# EAGLE design mostek-h (EAGLE 8.6.3)
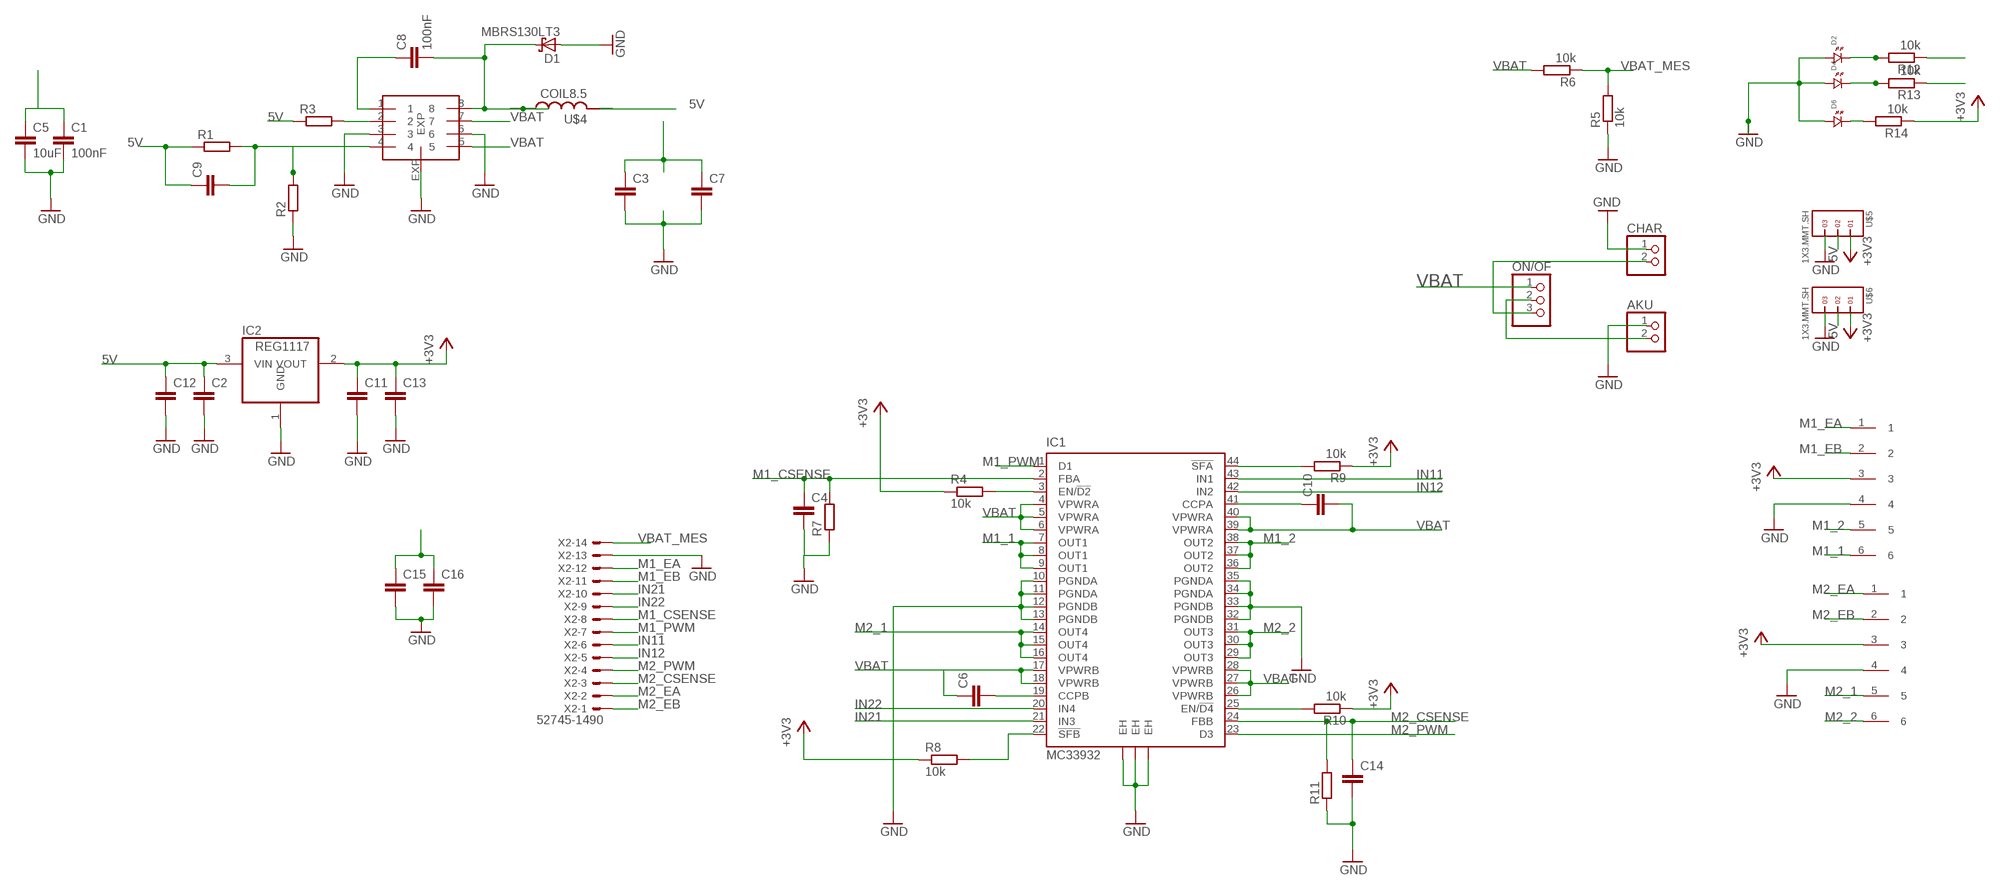
[diagram p0: schematic, sheet 1]

## Parts
AKU  PINHD-1X2/90  [1X02/90]
C1  100nF  C-EUC1210K  [C1210K]
C2  C-EUC0805  [C0805]
C3  C-EUC1210K  [C1210K]
C4  C-EUC0603  [C0603]
C5  10uF  C-EUC0603  [C0603]
C6  C-EUC0805  [C0805]
C7  C-EUC0603  [C0603]
C8  100nF  C-EUC0603  [C0603]
C9  C-EUC0603  [C0603]
C10  C-EUC0805  [C0805]
C11  C-EUC0805  [C0805]
C12  C-EUC1210  [C1210]
C13  C-EUC1210  [C1210]
C14  C-EUC0603  [C0603]
C15  C-EUC1210K  [C1210K]
C16  C-EUC0603  [C0603]
CHAR  PINHD-1X2/90  [1X02/90]
D1  MBRS130LT3  [SMB]
D2  LED.0805  [0805.LED]
D4  LED.0805  [0805.LED]
D6  LED.0805  [0805.LED]
IC1  MC33932  [HSOP44]
IC2  REG1117  [SOT223]
ON/OF  PINHD-1X3/90  [1X03/90]
R1  R-EU_R0603  [R0603]
R2  R-EU_R0603  [R0603]
R3  R-EU_R0603  [R0603]
R4  10k  R-EU_R0603  [R0603]
R5  10k  R-EU_R0603  [R0603]
R6  10k  R-EU_R0603  [R0603]
R7  R-EU_R0603  [R0603]
R8  10k  R-EU_R0603  [R0603]
R9  10k  R-EU_R0603  [R0603]
R10  10k  R-EU_R0603  [R0603]
R11  R-EU_R0603  [R0603]
R12  10k  R-EU_R0603  [R0603]
R13  10k  R-EU_R0603  [R0603]
R14  10k  R-EU_R0603  [R0603]
U$1  PAD_SMD_6X1  [SMD_6X1]
U$2  PAD_SMD_6X1  [SMD_6X1]
U$3  ST1S14  [HSOP8]
U$4  COIL8.5  [COIL1]
U$5  1X3.MMT.SH  [1X3_MMT.103.01.X.SH]
U$6  1X3.MMT.SH  [1X3_MMT.103.01.X.SH]
X2  52745-1490  [52745-1490]

## Nets
5V: C2.1 C3.1 C7.1 C9.1 C12.1 IC2.3(VIN) R1.1 R3.1 R13.1 U$4.2 U$5.2 U$6.2
+3V3: C11.1 C13.1 IC2.2(VOUT) R4.1 R8.1 R9.1 R10.1 R14.1 U$1.3 U$2.3 U$5.1 U$6.1
GND: AKU.1 C1.2 C2.2 C3.2 C4.2 C5.2 C7.2 C11.2 C12.2 C13.2 C14.2 C15.2 C16.2 CHAR.1 D1.A D2.P$1 D4.P$1 D6.P$1 IC1.10(PGNDA) IC1.11(PGNDA) IC1.12(PGNDB) IC1.13(PGNDB) IC1.32(PGNDB) IC1.33(PGNDB) IC1.34(PGNDA) IC1.35(PGNDA) IC1.EH@1(EH) IC1.EH@2(EH) IC1.EH@3(EH) IC2.1(GND) R2.1 R5.1 R7.1 R11.1 U$1.4 U$2.4 U$3.3 U$3.6 U$3.EXP U$5.3 U$6.3 X2.13
IN11: IC1.43(IN1) X2.6
IN12: IC1.42(IN2) X2.5
IN21: IC1.21(IN3) X2.10
IN22: IC1.20(IN4) X2.9
M1_1: IC1.7(OUT1) IC1.8(OUT1) IC1.9(OUT1) U$1.6
M1_2: IC1.36(OUT2) IC1.37(OUT2) IC1.38(OUT2) U$1.5
M1_CSENSE: C4.1 IC1.2(FBA) R7.2 X2.8
M1_EA: U$1.1 X2.12
M1_EB: U$1.2 X2.11
M1_PWM: IC1.1(D1) X2.7
M2_1: IC1.14(OUT4) IC1.15(OUT4) IC1.16(OUT4) U$2.5
M2_2: IC1.29(OUT3) IC1.30(OUT3) IC1.31(OUT3) U$2.6
M2_CSENSE: C14.1 IC1.24(FBB) R11.2 X2.3
M2_EA: U$2.1 X2.2
M2_EB: U$2.2 X2.1
M2_PWM: IC1.23(D3) X2.4
N$1: AKU.2 ON/OF.2
N$2: CHAR.2 ON/OF.3
N$3: C10.1 IC1.41(CCPA)
N$4: C8.1 U$3.1
N$5: C8.2 D1.C U$3.8 U$4.1
N$6: R3.2 U$3.2
N$7: C9.2 R1.2 R2.2 U$3.4
N$8: IC1.3(EN/!D2) R4.2
N$9: C6.2 IC1.19(CCPB)
N$11: IC1.22(!SFB) R8.2
N$12: IC1.25(EN/!D4) R10.2
N$13: IC1.44(!SFA) R9.2
N$17: D2.P$2 R12.2
N$19: D4.P$2 R13.2
N$20: D6.P$2 R14.2
VBAT: C1.1 C5.1 C6.1 C10.2 C15.1 C16.1 IC1.4(VPWRA) IC1.5(VPWRA) IC1.6(VPWRA) IC1.17(VPWRB) IC1.18(VPWRB) IC1.26(VPWRB) IC1.27(VPWRB) IC1.28(VPWRB) IC1.39(VPWRA) IC1.40(VPWRA) ON/OF.1 R6.2 R12.1 U$3.5 U$3.7
VBAT_MES: R5.2 R6.1 X2.14

## Library data of the parts
AKU CHAR = pinhead:PINHD-1X2: PIN HEADER
C1-C16 = rcl:C-EU: CAPACITOR, European symbol; SPICEPREFIX: C
D1 = diode:MBRS130LT3: Schottky Power Rectifier Source: http://www.onsemi.com/pub/Collateral/MBRS130LT3-D.PDF
D2 D4 D6 = standardparts:LED
IC1 = freescale:MC33932: 5.0 A Throttle Control H-Bridge Auto generated by make-symbol-device-package-bsdl.ulp Rev. 33 Source: http://www.freescale.com/files/analog/doc/data_sheet/MC33932.pdf?fpsp=1; MPN: MC33932VW; OC_FARNELL: 1701639; OC_NEWARK: 67P3304
IC2 = burr-brown:REG1117: 800mA and 1A Low Dropout (LDO) Positive Regulator 1.8V, 2.5V, 2.85V, 3.3V, 5V, and Adj; MPN: REG1117; OC_FARNELL: 1097566; OC_NEWARK: 14P6981
ON/OF = pinhead:PINHD-1X3: PIN HEADER
R1-R14 = rcl:R-EU_: RESISTOR, European symbol; SPICEPREFIX: R
U$1 U$2 = _zlacza:PAD_SMD_6X1
U$3 = _układy:ST1S14
U$4 = _elementy:COIL8.5
U$5 U$6 = headers(2mm)(samtec):1X3
X2 = con-molex:52745-1490: FFC/FPC-to-Board 0.50mm (.020") SMT Top Contact Right Angle, ZIF, Style Receptacle 52745 / 52435 Source: http://www.molex.com/product/ffc/52745.html; MF: WALDOM/MOLEX; MPN: 52745-1490; OC_FARNELL: unknown; OC_NEWARK: 38C9888

## Board
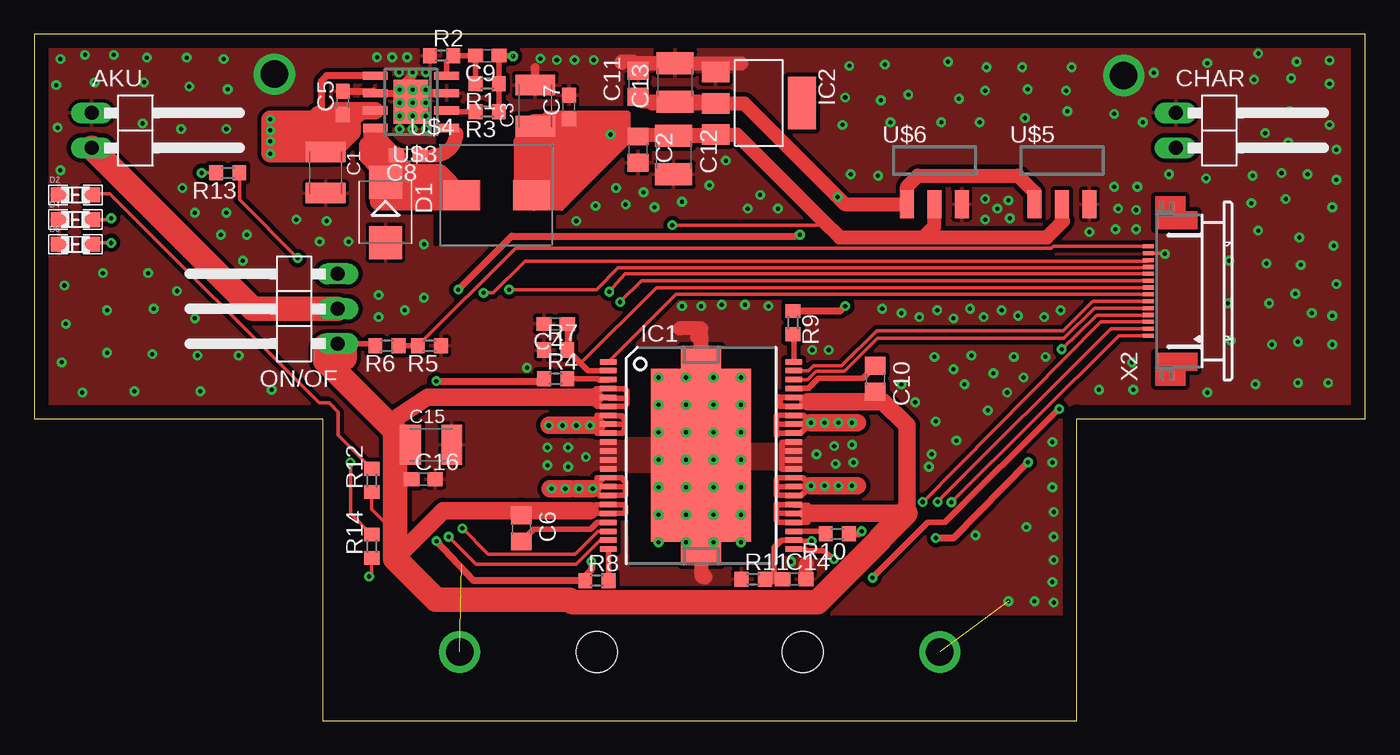
[diagram p1: board, top side]
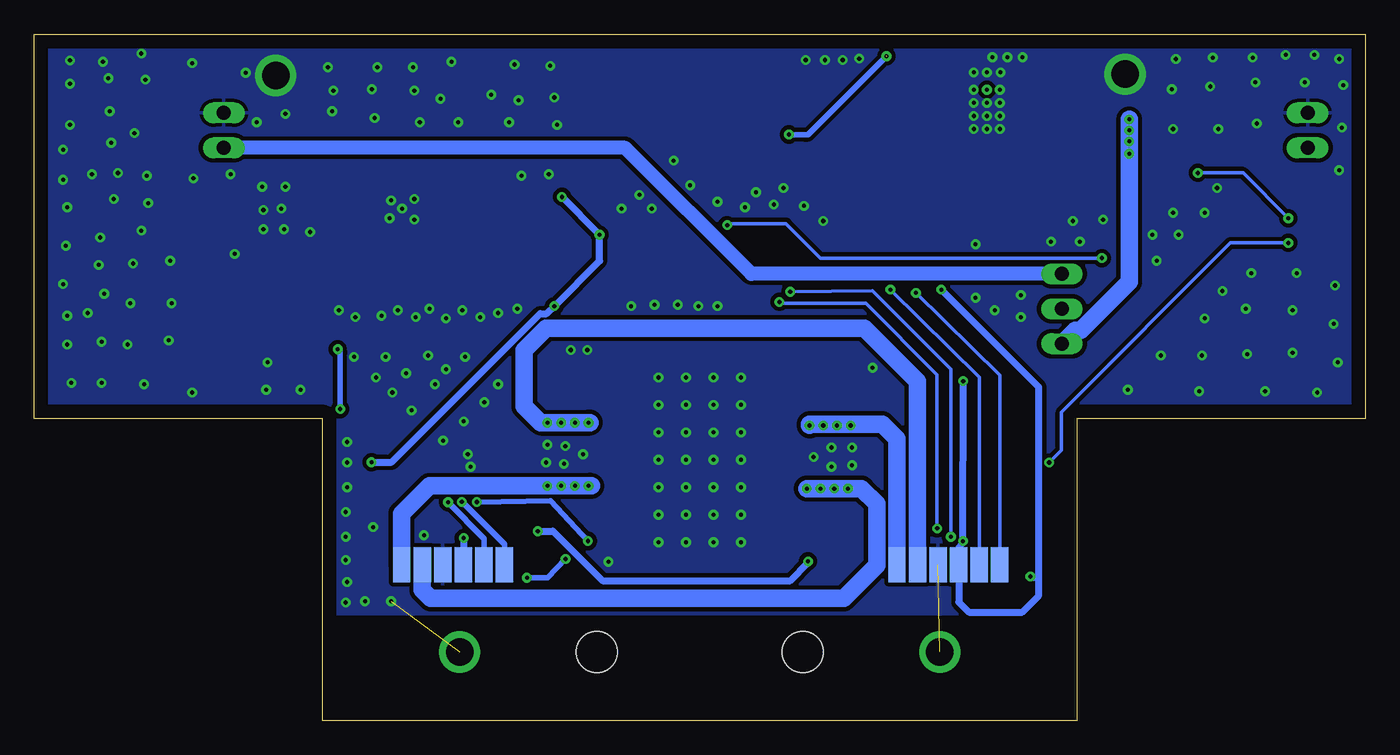
[diagram p2: board, bottom side, seen from below]

Size 97 x 50 mm. Coordinates in mm from the lower left corner, seen from the top.
Outline: 21,0 76,0 76,22 97,22 97,50 0,50 0,22 21,22 21,0
Copper layers (1*16): Top 0.035mm / dielectric 1.5mm / Bottom 0.035mm
Design rules "default *": minimum track width 6mil, minimum drill 0.3mm, track to track 6mil, track to pad 6mil, pad to pad 6mil, via to via 6mil, smd to smd 6mil, copper to edge 40mil, drill to drill 6mil, minimum pad ring 10mil, minimum via ring 8mil, stop-mask expansion 4mil, vias tented up to drill 50mil, thermal gap 10mil
Holes 3 mm at 41,5 56,5

### Footprints (pad centres in the part's own frame; a part is rotated, then mirrored left to right if it is on the bottom)
1X02/90 = drill 1.016 long: 1 -1.27,-3.81; 2 1.27,-3.81
C1210K = smd 1.5 x 2.9: 1 -1.5,0; 2 1.5,0
C0805 = smd 1.3 x 1.5: 1 -0.95,0; 2 0.95,0
C0603 = smd 1.1 x 1: 1 -0.85,0; 2 0.85,0
C1210 = smd 1.6 x 2.7: 1 -1.4,0; 2 1.4,0
SMB = smd 2.4 x 2.4: A 2.2,0; C -2.2,0
0805.LED = smd 1.25 x 1.1: P$1 -1.175,0; P$2 1.175,0
HSOP44 = smd 0.4 x 1.2: 1 -6.825,-6.75; 2 -6.175,-6.75; 3 -5.525,-6.75; 4 -4.875,-6.75; 5 -4.225,-6.75; 6 -3.575,-6.75; 7 -2.925,-6.75; 8 -2.275,-6.75; 9 -1.625,-6.75; 10 -0.975,-6.75; 11 -0.325,-6.75; 12 0.325,-6.75; 13 0.975,-6.75; 14 1.625,-6.75; 15 2.275,-6.75; 16 2.925,-6.75; 17 3.575,-6.75; 18 4.225,-6.75; 19 4.875,-6.75; 20 5.525,-6.75; 21 6.175,-6.75; 22 6.825,-6.75; 23 6.825,6.75; 24 6.175,6.75; 25 5.525,6.75; 26 4.875,6.75; 27 4.225,6.75; 28 3.575,6.75; 29 2.925,6.75; 30 2.275,6.75; 31 1.625,6.75; 32 0.975,6.75; 33 0.325,6.75; 34 -0.325,6.75; 35 -0.975,6.75; 36 -1.625,6.75; 37 -2.275,6.75; 38 -2.925,6.75; 39 -3.575,6.75; 40 -4.225,6.75; 41 -4.875,6.75; 42 -5.525,6.75; 43 -6.175,6.75; 44 -6.825,6.75 | smd 12.6 x 7.3: EH@1 0,0 | smd 1.7 x 2.9: EH@2 -7.15,0; EH@3 7.15,0
SOT223 = smd 1.499 x 2.007: 1 -2.261,-3.15; 2 0.025,-3.15; 3 2.311,-3.15 | smd 3.81 x 2.007: 4 0,3.15
1X03/90 = drill 1.016 long: 1 -2.54,-3.81; 2 0,-3.81; 3 2.54,-3.81
R0603 = smd 1 x 1.1: 1 -0.85,0; 2 0.85,0
SMD_6X1 = smd 2.54 x 1.27: 1 2.54,0.57; 2 2.54,-0.93; 3 2.54,-2.43; 4 2.54,-3.93; 5 2.54,-5.43; 6 2.54,-6.93
HSOP8 = smd 0.6 x 1.8: 1 -1.905,-2.6; 2 -0.635,-2.6; 3 0.635,-2.6; 4 1.905,-2.6; 5 1.905,2.6; 6 0.635,2.6; 7 -0.635,2.6; 8 -1.905,2.6 | smd 3.2 x 2.51: EXP 0,0
COIL1 = smd 2.7 x 2.2: 1 -2,0; 2 3.1,0
1X3_MMT.103.01.X.SH = smd 1.016 x 2.032: 1 -2,-3.175; 2 0,-3.175; 3 2,-3.175
52745-1490 = smd 0.3 x 0.8: 1 -3.25,2.5; 2 -2.75,2.5; 3 -2.25,2.5; 4 -1.75,2.5; 5 -1.25,2.5; 6 -0.75,2.5; 7 -0.25,2.5; 8 0.25,2.5; 9 0.75,2.5; 10 1.25,2.5; 11 1.75,2.5; 12 2.25,2.5; 13 2.75,2.5; 14 3.25,2.5

### Placement (x,y rotation side)
AKU  8,43 270 top
C1  21.23,39.92 270 top
C2  44,41.6 270 top
C3  36.51,44.8 90 top
C4  38,28.9 180 top
C5  22.5,45.01 90 top
C6  35.5,14 270 top
C7  38.97,44.7 90 top
C8  27.26,41.2 180 top
C9  33.01,48.45 180 top
C10  61.3,24.9 270 top
C11  44,46.4 90 top
C12  46.6,41.2 270 top
C13  46.7,46.5 90 top
C14  55.4,10.3 0 top
C15  28.92,20.09 0 top
C16  28.37,17.58 0 top
CHAR  87,43 270 top
D1  25.59,37.02 270 top
D2  3,38.3 0 top
D4  3,36.5 0 top
D6  3,34.7 0 top
IC1  48.6,19.32 270 top
IC2  52.8,45 270 top
ON/OF  18.3,30 90 top
R1  33.01,46.41 180 top
R2  29.68,48.45 0 top
R3  33.01,44.37 180 top
R4  38,24.9 0 top
R5  28.8,27.3 180 top
R6  25.7,27.3 180 top
R7  38,27 0 top
R8  41,10.2 0 top
R9  55.3,29 270 top
R10  58.53,13.6 180 top
R11  52.4,10.3 0 top
R12  24.6,17.5 90 top
R13  14.1,39.9 180 top
R14  24.6,12.7 90 top
U$1  27.2,13.9 270 bottom
U$2  63.3,13.9 270 bottom
U$3  27.45,45.08 90 top
U$4  33.14,38.28 0 top
U$5  74.9,40.8 0 top
U$6  65.6,40.8 0 top
X2  83.7,31.3 90 top

### Tracks (layer width: path | path; a pad name or v marks a point on that pad's centre or on a via)
5V  (via drill 0.3)  (1 unrouted)
  Top 0.254: R13.1 14.95,37.95 v19.2,33.7 | v46.5,36.1 57.1,36.1 57.45,36.45
  Top 0.406: R3.1 R1.1 C9.1 34.85,48.45
  Top 0.508: 35.45,42.25 36.05,42.85 C3.1 37.41,44.2 43.2,44.2 43.2,42.2 38.4,37.4 36.4,37.4 35.2,38.6 35.2,41.99 | 35.45,42.25 35.2,41.99 | 35.2,41.99 35.2,42.3 35.6,42.7 | U$4.2 35.45,39.07 35.45,42.25
  Top 0.61: C7.1 38.8,43.69 38.8,43.3
  Top 1.016: 43.85,42.7 44,42.7 | 49.64,42.7 IC2.3 | 43.85,42.7 C2.1 44,42.7 | 43.85,42.7 42.7,42.7 v42,42.7 42.2,42.7 42.2,43.3 | 49.64,42.7 51.2,42.7 57.45,36.45 58.7,35.2 64.8,35.2 | 64.8,35.2 65.6,36 U$6.2 | 64.8,35.2 73.8,35.2 75,36.4 74.9,36.5 U$5.2 | 44,42.7 49.64,42.7 | C12.1 49.64,42.6 49.64,42.7
  Top 1.778: U$4.2 36.24,42.66 36.05,42.85 | C3.1 38.8,43.3 42.2,43.3 42.3,43.4 | 42.7,42.7 38.4,38.4 37.4,38.4 37.4,41.7 38.2,42.5 40.7,42.5 | 40.8,42.5 40.7,42.5 | 40.7,42.5 38.6,40.4
  Bottom 0.254: v19.2,33.7 39.7,33.7 42.2,36.2 46.4,36.2 v46.5,36.1
  Bottom 0.406: v42,42.7 40.94,42.7 40.6,42.7 v34.9,48.4
+3V3  (via drill 0.3)
  Top 0.254: R14.1 24.6,10.7 v24.4,10.5
  Top 0.508: R8.1 39.8,10.2 | 39.8,10.2 32,10.2 v29.31,13.07 | v29.3,24.73 36.88,24.73 R4.1 | v30.9,31.4 34.8,35.3 55.5,35.3 55.6,35.4 v55.8,35.4 | R9.1 58.75,29.85 v59.1,30.2 | v72.43,18.83 67,13.3 v65.7,13.3 | R10.1 60.1,13.6 v60.3,13.8 | v40.6,11.6 40.6,11 39.8,10.2
  Top 1.016: IC2.2 49.52,45.1 C13.1 44.9,45.1 | 44.9,45.1 44.35,45.1 C11.1 | 44.9,45.1 45.02,44.98 IC2.2 | IC2.2 51.73,44.98 v58.55,38.15 59.08,37.62 U$6.1 63.6,38.9 64.4,39.7 71.7,39.7 72.9,38.5 U$5.1
  Bottom 0.254: v24.4,10.5 24.2,10.3 23.8,10.3
  Bottom 0.508: v29.3,24.73 v29.31,13.07 29.63,12.57 U$1.3 29.63,8.63 28.9,7.9 25,7.9 23.8,9.1 23.8,10.3 23.8,24.3 v30.9,31.4 | v58.55,38.15 v55.8,35.4 55.8,33.5 v59.1,30.2 59.66,29.64 60.13,29.64 70.94,18.83 v72.43,18.83 | v65.7,13.3 65.7,11.39 U$2.3 | v60.3,13.8 59.2,13.8 55.6,10.2 41.9,10.2 40.6,11.5 v40.6,11.6
GND  (via drill 0.3, 2)  (2 unrouted)
  Top 0.254: X2.13 82.35,34.05 v82.4,34
  Top 0.406: IC1.35 54.5,20.29 54.5,19.64 | 54.5,19.64 54.5,18.99 | 54.5,18.99 54.5,18.3 55.35,18.3 IC1.32 | IC1.33 54.5,18.99 | IC1.34 54.5,19.64
  Top 0.508: C5.2 24.71,45.85 U$3.6 27.35,45.72 28.14,45.72 28.21,45.64
  Top 0.61: 27.57,45.2 27.89,45.2 28.41,45.72 U$3.3 | 27.57,45.2 27.34,45.2 | 26.82,45.77 26.82,45.64 27.26,45.2 27.34,45.2 | 26.82,45.77 v26.62,45.96 | U$3.EXP 26.7,45.08 v26.62,45.01 | U$3.EXP 27.57,45.2 | 26.82,45.77 26.82,46.27 27.58,47.03 v27.58,47.23 | U$3.EXP 27.34,45.2 | C3.2 36.5,46.32 36.5,47.6
  Top 1.016: IC1.EH@1 49.5,19.32 v49.5,25 | 48.3,27.94 48.6,27.94 IC1.EH@1 | IC1.EH@2 48.6,28.57 47.03,28.57 | U$3.EXP 27.45,45.72 27.35,45.72 | IC1.EH@1 49.02,19.32 49.02,13.31 | 49.02,13.31 49.5,13.31 v49.5,13 | 48.69,10.49 48.69,10.82 48.6,10.82 IC1.EH@3 48.6,13.31 49.02,13.31 | 48.64,10.49 48.69,10.49 | 48.69,10.49 48.89,10.49 48.89,10.44 | C13.2 43.63,47.9 43.63,48.01 42.82,48.01 42.82,47.9 | C11.2 44,47.88 51.53,47.88 | C14.2 56.25,11.46 56.28,11.46
  other vias: 28.53,47.23 26.62,43.1 27.58,43.1 28.53,43.1 28.53,45.96 27.58,44.05 26.62,44.05 27.58,45.01 28.53,45.01 28.53,44.05 26.58,47.23 45.5,25 47.5,25 51.5,25 45.5,23 45.5,21 45.5,19 45.5,17 45.5,15 45.5,13 47.5,13 51.5,13 51.5,15 51.5,17 51.5,19 51.5,21 51.5,23 47.5,19 49.5,19 47.5,21 49.5,21 47.5,17 49.5,17 49.5,15 47.5,15 47.5,23 49.5,23 37.4,19.9 37.4,18.6 38.9,18.5 38.9,19.9 40.2,19.2 59.6,20.1 59.7,18.8 58.4,18.7 58.3,20 57,19.4 26.08,48.33 27.18,48.33 24.98,48.33 36.88,48.23 38.08,48.13 39.38,48.13 40.78,48.13 68.6,13.5 65.4,19.4 64.2,23.2 67.2,20.4 69.5,22.6 67.8,24.5 65.6,26.5 68.3,26.6 71.4,26.5 73.7,26.5 72.1,25 70.9,23.9 69.9,25.3 74.2,20.3 74.2,18.8 74.2,17 74.3,15.2 74.3,13.4 74.3,11.7 74.2,10.1 74.3,8.6 72.9,8.7 71,8.7 72.3,14.1 35.9,25.7 25.1,31 25.1,29.4 28.4,30.8 27,29.9 65.7,21.8 65.2,18.5 63.2,24.5 67,25.6 17.5,47.1 31,5 66,5 79.4,47 54.2,37.3 56.7,27 64.5,29.4 65.8,29.9 67,29.3 68.2,30 69.2,29.4 70.5,29.9 71.7,29.5 77.6,24.1 80.1,24.1 80,26.1 85.5,23.9 69.3,36.5 69.3,38 71,37.9 71.1,36.6 70.2,37.3 76.9,35.6 78.8,35.8 80.3,35.8 80.3,37.2 80.4,38.9 78.7,38.9 79,37.3 82.7,39.8 85.4,39.5 88.8,39.7 89.2,35.7 81.6,47.2 85.5,47.9 28.4,34.7 22.9,34.9 20.8,34.9 19.1,36.5 21.3,36.4 39.5,36.4 40.9,37.5 42.4,38.8 43.1,37.6 44.4,38.5 45.2,37.4 47.2,37.8 49.2,39 50.4,40.8 52,37.3 52.9,38.3 59.5,39.8 61.5,39.7 58.9,43.4 59.1,45.4 59.4,47.7 62,47.8 61.7,45.2 62.4,43.6 63.7,45.6 66.6,48 67.4,45.3 66.1,43.6 68.9,43.6 69.3,45.9 69.4,47.6 72,47.6 72.4,46 72.2,43.9 75.3,44.4 75.2,45.9 75.6,47.6 87.1,33.5 89.8,33.3 87,30.4 90,30.4 87.2,27.7 90.2,27.4 89,24.5 92.1,24.6 94.3,24.6 94.6,27.4 92.1,27.6 93.1,29.7 94.6,29.5 91.9,31.1 94.9,31.8 94.7,34.6 92.3,33.2 92.2,35.2 94.6,37.4 91.2,38 92.8,39.8 94.9,39.4 94.9,41.6 91.4,42.1 88.7,37.7 90.9,39.9 89.7,42.8 91.5,44.4 94.4,43.4 94.4,46.4 91.6,46.8 88.9,46.7 89.2,48.6 92,48 94.4,48.1 78.7,44.2 80.8,43.6 17.3,24.1 12.1,24 7.3,24 3.5,23.9 2,26.1 2.3,28.9 2.2,31.7 5,32.6 8.3,32.6 8.7,30 5.3,29.9 5.3,26.8 8.6,26.7 11.9,26.6 14.9,26.6 11.7,29.3 10.4,31.3 15.2,33.5 15.5,35.4 13.6,35.4 11.7,37 14,37 10.8,38.8 1.9,40.1 1.7,43.2 1.6,46.3 1.9,48.2 3.7,48.5 5.8,48.5 8.2,48.3 11.1,48.3 13.8,48.2 14.1,46 11.3,46.2 8,46.5 4.4,46.5 10.7,43.1 14,43.1 7.9,43.5 47.2,30.2 48.6,30.2 50.1,30.3 51.8,30.3 53.5,30.2 57.9,27 61.8,30 63.2,29.7 73.6,29.4 74.8,29.9 55.16,11.58
  pour Top (isolate 0.305, no thermals): 36.8,20.4 36.8,17.9 60.2,17.9 60.1,20.6
  pour Bottom (isolate 0.305): 0.1,49.9 0.1,21.9 21.1,21.9 21.1,7.8 76,7.8 76,22 97.1,22 97.1,50 0.1,50
  pour Top (isolate 0.305): 0.2,50 0.2,22.1 21.2,22.1 21.2,7.8 76.1,7.8 76.1,21.9 97.1,21.9 97.1,50 0.3,50
IN11
  Top 0.254: IC1.43 56.44,25.49 56.79,25.84 58.84,25.84 61.4,28.4 75,28.4 77.15,30.55 X2.6
IN12
  Top 0.254: IC1.42 56.36,24.84 56.96,25.44 59.04,25.44 61.45,27.84 75.05,27.84 77.25,30.05 X2.5
IN21  (via drill 0.3)
  Top 0.254: IC1.21 41.24,13.14 39.5,11.4 32.2,11.4 v30.2,13.4 | v41.9,31.25 43.05,32.55 X2.10
  Bottom 0.254: v30.2,13.4 30.2,25.6 35.9,31.3 v41.9,31.25
IN22  (via drill 0.3)
  Top 0.254: IC1.20 41.08,13.79 39.4,12.12 33.08,12.12 v31.2,14 | v42.7,30.5 44.25,32.05 X2.9
  Bottom 0.254: v31.2,14 31.2,25.2 36.4,30.4 42.6,30.4 v42.7,30.5
M1_1  (via drill 0.3)
  Top 0.406: 43,21.6 43,22 42.8,22.2 41.89,22.2 IC1.7 41,22.24 41,21.59 | 43,21.6 43,21.1 42.84,20.94 IC1.9 41,20.94 41,21.5 41,21.59 | 43,21.6 42.99,21.59 IC1.8 41,21.59
  Top 1.016: v39.5,21.5 39.41,21.5 | 38.78,21.5 v38.5,21.5 v40.5,21.5
  Top 1.27: v37.5,21.5 38.78,21.5 39.41,21.5 v40.5,21.5 41,21.5
  Bottom 1.27: U$1.6 34.13,20.53 35.2,21.6 40.5,21.6 v40.5,21.5
M1_2  (via drill 0.3)
  Top 0.406: v56.6,21.7 56.06,22.24 IC1.38 54.14,22.24 54.1,22.2 54.1,21.7 | v56.6,21.7 56.49,21.59 IC1.37 54.21,21.59 54.1,21.7 | v56.6,21.7 55.84,20.94 IC1.36 54.24,20.94 54.1,20.8 54.1,21.7
  Top 1.016: v59.6,21.7 58.47,21.7 | v58.6,21.7 57.83,21.7 | v57.6,21.7 v56.6,21.7
  Top 1.27: v56.6,21.7 57.83,21.7 58.47,21.7 60,21.7
  Bottom 1.27: U$1.5 32.63,24.73 36.5,28.6 59.7,28.6 61.3,27 61.3,22.9 60.1,21.7 v56.6,21.7 56.5,21.7
M1_CSENSE
  Top 0.254: 39.83,26.02 45.35,31.55 X2.8
  Top 0.406: 39.02,26.82 R7.2 C4.1 39.02,28.73 39.02,26.82 | 39.02,26.82 39.83,26.02 40.36,25.49 IC1.2
M1_EA  (via drill 0.3)
  Top 0.254: X2.12 81.13,33.48 35.76,33.48 33.44,31.16 v32.74,31.16
  Bottom 0.254: U$1.1 26.63,25.16 v32.74,31.16
M1_EB  (via drill 0.3)
  Top 0.254: X2.11 81.13,32.98 42.55,32.98 40.98,31.4 v34.6,31.4
  Bottom 0.254: U$1.2 28.13,25.03 v34.6,31.4
M1_PWM
  Top 0.254: X2.7 46.76,31.05 IC1.1
M2_1  (via drill 0.3)
  Top 0.406: IC1.14 41.49,17.69 v40.7,16.9 | 41,17.04 IC1.15 43.06,17.04 43.1,17 | 41,17.04 40.84,17.04 v40.7,16.9 | IC1.14 42.81,17.69 43.1,17.4 43.1,17 | 43.1,17 43.1,16.4 IC1.16 41.21,16.39 41.05,16.55 40.7,16.55 v40.7,16.9 | IC1.14 41,17.69 41,17.04 | v39.7,16.9 v40.7,16.9 | 39,16.9 39.5,16.9
  Top 1.016: v37.7,16.9 39,16.9 | v38.7,16.9 v40.7,16.9
  Top 1.27: 39.5,16.9 v40.7,16.9 | 37.6,16.9 39,16.9
  Bottom 1.27: U$2.5 68.73,9.53 68.1,8.9 38,8.9 35.6,11.3 35.6,15.8 36.7,16.9 v40.7,16.9
M2_2  (via drill 0.3)
  Top 0.406: v56.6,17.1 56.01,17.69 IC1.31 54.19,17.69 54.1,17.6 54.1,17 | v56.6,17.1 56.54,17.04 IC1.30 54.14,17.04 54.1,17 | v56.6,17.1 55.89,16.39 IC1.29 54.1,16.4 54.1,17
  Top 1.016: v58.6,17.1 59.1,17.1 | v59.6,17.1 57.83,17.1 v57.6,17.1
  Top 1.27: v56.6,17.1 57.83,17.1 59.1,17.1 60,17.1
  Bottom 1.27: U$2.6 70.23,15.07 68.2,17.1 v56.6,17.1 56.4,17.1
M2_CSENSE  (via drill 0.3, 0.3 pad 0.55)
  Top 0.254: v64.75,15.92 77.75,29.05 X2.3
  Top 0.406: C14.1 R11.2 53.45,10.1 53.9,10.1 53.9,12.6 54.44,13.14 IC1.24 v56.65,13.08
  Bottom 0.406: v56.65,13.08 59.37,16 v64.75,15.92
M2_EA  (via drill 0.3)
  Top 0.254: v65.84,15.94 78.45,28.55 X2.2
  Bottom 0.406: U$2.1 62.73,12.83 v65.84,15.94
M2_EB  (via drill 0.3)
  Top 0.254: v66.84,15.91 79.05,28.05 X2.1
  Bottom 0.406: U$2.2 64.23,13.23 v66.84,15.91
M2_PWM  (via drill 0.3)
  Top 0.254: v74.88,27.06 77.43,29.55 X2.4
  Top 0.406: IC1.23 56.21,12.49 56.23,12.37 57.52,12.37 v58.28,11.78 | v61.1,10.4 65.14,14.44 66.37,14.44 74.63,22.7 v74.7,22.7
  Bottom 0.406: v58.28,11.78 59.6,10.4 v61.1,10.4 | v74.7,22.7 74.7,26.82 v74.88,27.06
N$1
  Top 1.778: AKU.2 15.92,30 ON/OF.2
N$2
  Bottom 1.016: ON/OF.3 44.74,32.54 53.93,41.73 CHAR.2
N$3
  Top 0.406: IC1.41 55.96,24.19 55.99,24.22 56.42,24.22 57.16,24.96 60.41,24.96 C10.1
N$4
  Top 0.508: U$3.1 30.36,43.17 arc-90 30.75,42.78
  Top 0.813: C8.1 29.16,41.2
  Top 1.016: 29.16,41.2 arc90 30.75,42.78
N$5
  Top 0.508: 24.9,42.5 24.86,42.55 U$3.8 24.78,43.1 24.21,43.1 24.21,41.99 24.3,41.9 | U$4.1 27.72,38.28 26.9,39.1 | 26.5,39.5 26.9,39.1 | 26.9,39.1 29.3,39.1 29.8,38.6 29.8,38.5 26.5,38.5 26.7,38.7 29.3,38.7
  Top 1.016: D1.C 25.3,39.23 25.3,38.7
  Top 1.27: 25.8,41.6 24.9,42.5 24.3,41.9 24.3,41.1 25,40.4 25,40.3 25.3,40 25.3,38.7 25.1,38.5 25.1,37.8 30.66,37.8 U$4.1 29.52,39.9 27.24,39.9 26.84,40.3 26.41,40.3 C8.2 26.02,40.8 25.6,40.8 25.6,40.9 24.9,41.6 25.8,41.6 | 26.41,40.88 26.41,40.99 25.8,41.6
N$6
  Top 0.406: R3.2 30.13,44.37 U$3.2
N$7
  Top 0.406: R1.2 C9.2 R2.2 30.05,47.97 U$3.4
N$8
  Top 0.406: R4.2 41.1,24.9 41.2,24.8 41.81,24.8 IC1.3
N$9
  Top 0.406: C6.2 36.39,13.94 40.55,13.94 41.04,14.44 IC1.19
N$10
  cutout Top (isolate 0.305): 29.2,37 29.2,34.7 37.9,34.7 37.9,43.5 29.4,43.5 29.4,37.1 29.2,37.1
N$11
  Top 0.406: IC1.22 R8.2
N$12
  Top 0.406: IC1.25 57.74,13.79 R10.2
N$13
  Top 0.406: IC1.44 55.35,28.1 R9.2
N$14
  cutout Top (isolate 0.305): 43.6,27.2 53.8,27.2 54.5,20.5 54.5,20.4 51.7,20.4 51.7,18.1 53.8,18.1 53.8,11.3 43.5,11.3 43.5,11.5 43.3,17.9 45.7,17.9 45.7,20.8 43.5,20.8 43.5,27.2 44,27.2
N$15  (via drill 0.3)
  other vias: 27.58,45.96
N$17
  Top 0.254: R12.2 22.14,20.81 22.14,22.47 21.47,23.14 20.76,23.14 5.5,38.4 4.27,38.4 D2.P$2
N$19  (via drill 0.3)
  Top 0.254: D4.P$2 5.5,36.5 v5.6,36.6 | v12.2,39.9 R13.2
  Bottom 0.254: v5.6,36.6 8.9,39.9 v12.2,39.9
N$20  (via drill 0.3)
  Top 0.254: R14.2 23.04,15.11 v23.04,18.8 | v5.6,34.8 4.27,34.8 D6.P$2
  Bottom 0.254: v23.04,18.8 22.14,19.7 22.14,22.47 9.82,34.8 v5.6,34.8
VBAT  (via drill 0.3)
  Top 0.254: 26.3,13.7 24.6,15.4 R12.1 | C15.1 26.78,20.09 26.3,19.61 | C16.1 27.34,17.75 26.3,17.75
  Top 0.406: 40.8,23.6 40.8,24 40.99,24.19 IC1.4 43.01,24.19 43.2,24 43.2,23.5 | 40.8,23.6 40.8,23.1 41.01,22.89 IC1.6 42.99,22.89 43.2,23.1 43.2,23.5 | 40.8,23.6 40.86,23.54 IC1.5 41.89,23.5 43.2,23.5 | 56.4,15.1 56.4,14.5 56.34,14.44 IC1.26 54.26,14.44 54.1,14.6 54.1,15.2 | 56.4,15.1 56.4,15.7 55.39,15.7 IC1.28 54.16,15.74 54.1,15.8 54.1,15.2 | 56.4,15.1 IC1.27 54.21,15.09 54.1,15.2 | IC1.39 56.4,22.9 56.4,23.23 56.4,23.4 56.26,23.54 IC1.40 54.26,23.54 | IC1.39 | IC1.39 54.4,22.9 | 54.4,22.9 54.3,22.9 | 54.26,23.54 54.2,23.6 | 54.26,23.54 54.4,23.4 54.4,22.9 | C6.1 35.5,15.3 | ON/OF.1 24.69,27.46 R6.2 | IC1.17 42.96,15.74 43.1,15.6 43.1,15.1 43.09,15.09 IC1.18 40.71,15.09 40.5,15.3 40.94,15.74 IC1.17
  Top 0.508: U$3.5 21.3,46.98 20.91,46.59 20.91,44.37 20.7,44.16
  Top 1.016: 22.79,44.45 C5.1 22.05,44.16 22.05,44.45 | C1.1 21.23,41.3 21.6,41.3 | 21.8,25.6 21.8,26.4 22.6,26.4 | ON/OF.1 22.11,27.3 21.2,27.3 | 61.3,23.23 61.18,23.23 | C10.2 61.3,23.23 | 61.3,23.23 61.87,23.23
  Top 1.27: 40.86,23.54 28.67,23.57 25.89,21.74 23.86,23.54 23.8,23.48 | 56.4,23.23 61.18,23.23 61.87,23.23 63.6,21.5 63.6,15.2 63.5,15.1 56.4,15.1 | 26.3,11.8 29.8,15.3 35.5,15.3 40.5,15.3 | 20.5,43.8 v17.2,43.8 v17.2,42.2 | 20.5,43.8 20.7,43.6 | v17.2,42.2 v17.2,41.3 21.6,41.3 23.17,42.87 23.17,43.8 23.81,44.45 U$3.7 22.05,44.45 21.3,43.7 21.3,43.6 | v17.2,43 21.9,43 22.2,43.3 22.2,43 21.3,42.1 17.3,42.1 v17.2,42.2 | 20.7,44.16 20.5,43.96 20.5,43.8
  Top 1.778: 22.6,26.4 22.6,27.1 22.4,27.3 21.2,27.3 21.2,26.2 21.8,25.6 23.86,23.54 26.3,21.1 26.3,19.61 26.3,17.75 26.3,13.7 26.3,11.8 29.3,8.8 39.03,8.8 39.22,8.61 57.08,8.61 61.65,13.17 61.65,13.24 63.5,15.1
  Bottom 1.27: ON/OF.1 21.12,28.45 20.71,28.45 17.2,31.96 v17.2,43.8
VBAT_MES
  Top 0.254: X2.14 74.26,34.55 74.13,34.41 35.06,34.41 R5.2
  Top 0.406: R6.1 R5.2